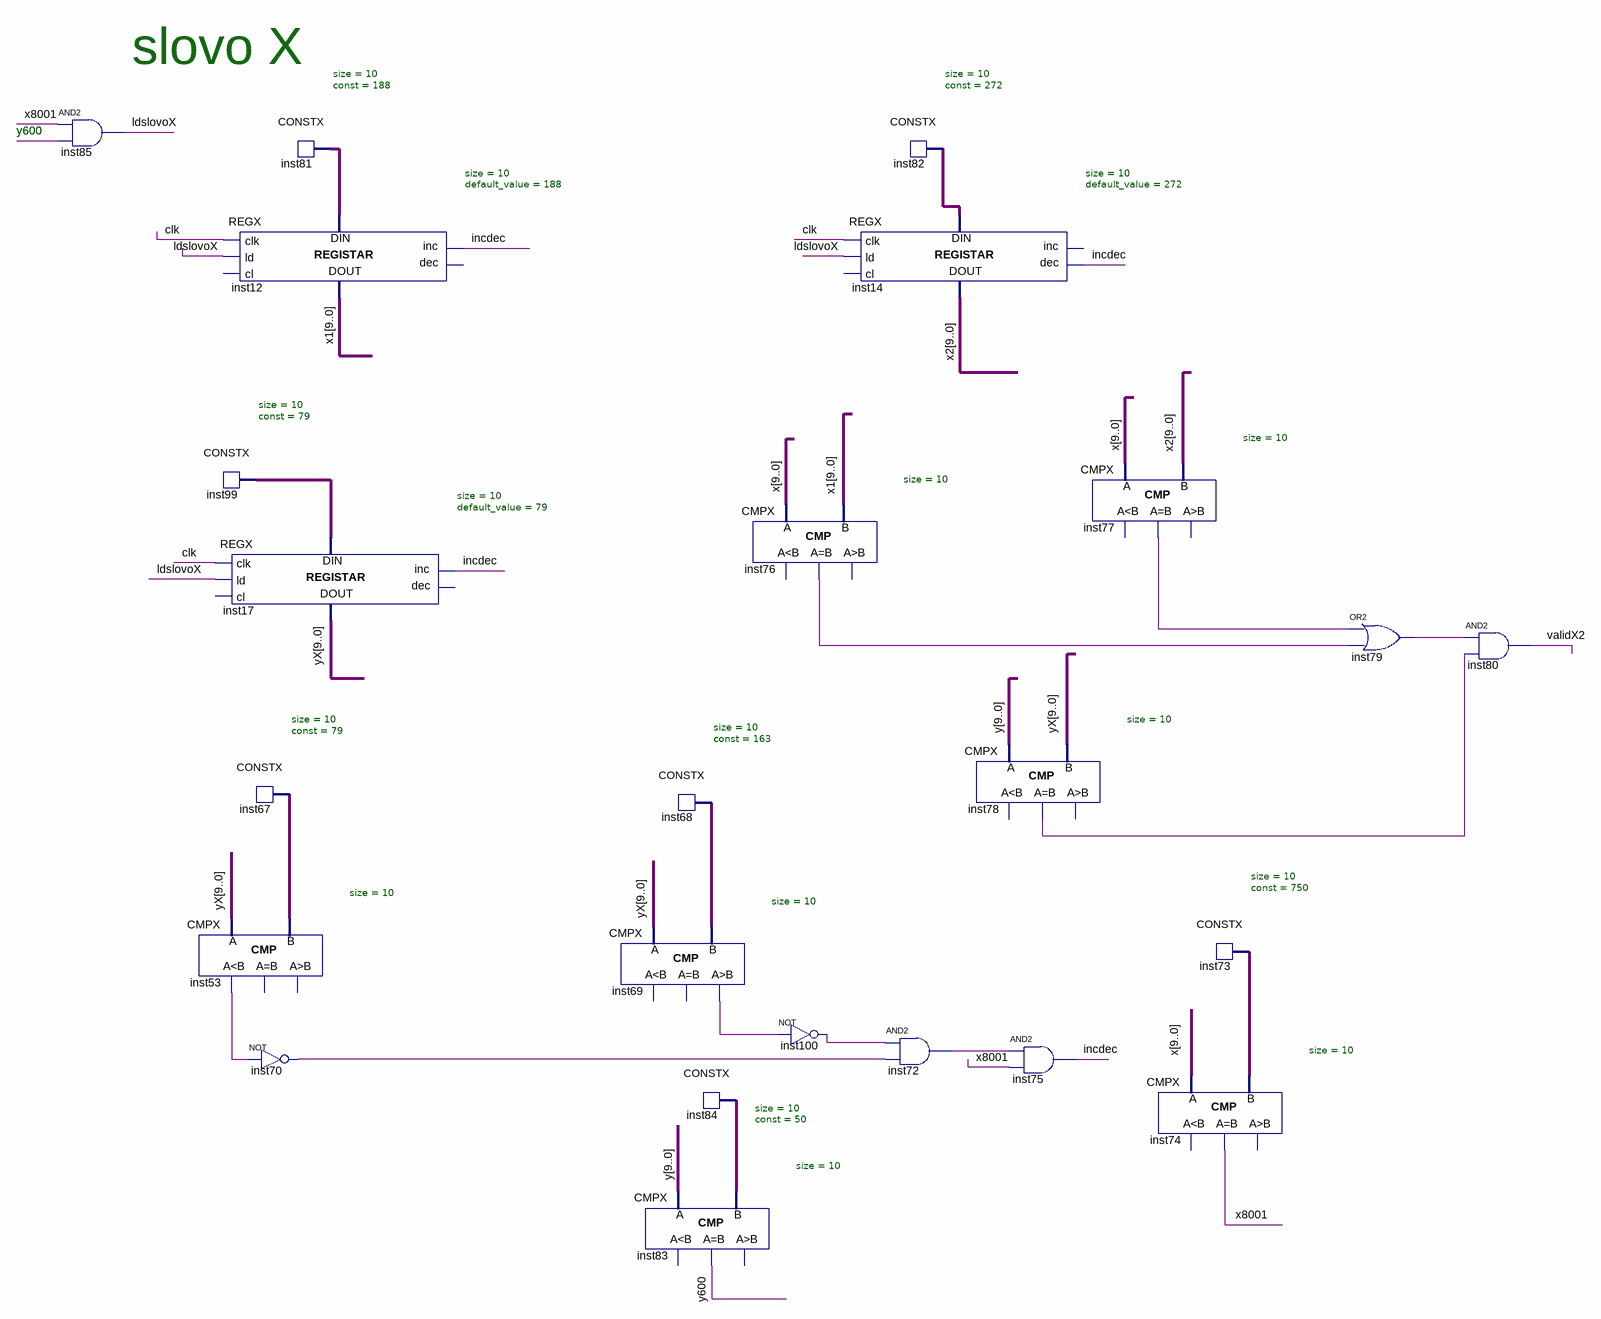
[diagram p0: schematic sheet]
// Quartus schematic xxxx.bdf as structural Verilog: 24 symbols, 0 pins
module xxxx (
);

  wire clk, incdec, inst53_ls, inst69_gr, inst70_out, inst72_out, inst76_eq, inst77_eq, inst78_eq,
       inst79_out, inst100_out, ldslovoX, validX2, x8001, y600;
  wire [9:0] inst67_data, inst68_data, inst73_data, inst81_data, inst82_data, inst84_data, inst99_data, x,
       x1, x2, y, yX;

  and inst85 (ldslovoX, x8001, y600);
  CMPX #(.size(10)) inst53 (.A(yX), .B(inst67_data), .ls(inst53_ls));  // open: eq, gr
  REGX #(.size(10), .default_value(188)) inst12 (
    .clk(clk), .ld(ldslovoX), .inc(incdec), .data_in(inst81_data), .data_out(x1));  // open: cl, dec
  CONSTX #(.size(10), .\const (79)) inst99 (.data(inst99_data));
  REGX #(.size(10), .default_value(79)) inst17 (
    .clk(clk), .ld(ldslovoX), .inc(incdec), .data_in(inst99_data), .data_out(yX));  // open: cl, dec
  CONSTX #(.size(10), .\const (79)) inst67 (.data(inst67_data));
  not inst70 (inst70_out, inst53_ls);
  CONSTX #(.size(10), .\const (188)) inst81 (.data(inst81_data));
  CONSTX #(.size(10), .\const (163)) inst68 (.data(inst68_data));
  CMPX #(.size(10)) inst69 (.A(yX), .B(inst68_data), .gr(inst69_gr));  // open: ls, eq
  CMPX #(.size(10)) inst83 (.A(y), .B(inst84_data), .eq(y600));  // open: ls, gr
  CONSTX #(.size(10), .\const (50)) inst84 (.data(inst84_data));
  CMPX #(.size(10)) inst76 (.A(x), .B(x1), .eq(inst76_eq));  // open: ls, gr
  not inst100 (inst100_out, inst69_gr);
  REGX #(.size(10), .default_value(272)) inst14 (
    .clk(clk), .ld(ldslovoX), .dec(incdec), .data_in(inst82_data), .data_out(x2));  // open: cl, inc
  CONSTX #(.size(10), .\const (272)) inst82 (.data(inst82_data));
  and inst72 (inst72_out, inst100_out, inst70_out);
  CMPX #(.size(10)) inst78 (.A(y), .B(yX), .eq(inst78_eq));  // open: ls, gr
  and inst75 (incdec, inst72_out, x8001);
  CMPX #(.size(10)) inst77 (.A(x), .B(x2), .eq(inst77_eq));  // open: ls, gr
  CMPX #(.size(10)) inst74 (.A(x), .B(inst73_data), .eq(x8001));  // open: ls, gr
  CONSTX #(.size(10), .\const (750)) inst73 (.data(inst73_data));
  or inst79 (inst79_out, inst77_eq, inst76_eq);
  and inst80 (validX2, inst79_out, inst78_eq);

  // Notes on the sheet:
  //   slovo X
  //   y600
endmodule
